# Altium project acondicionamiento.PrjPCB
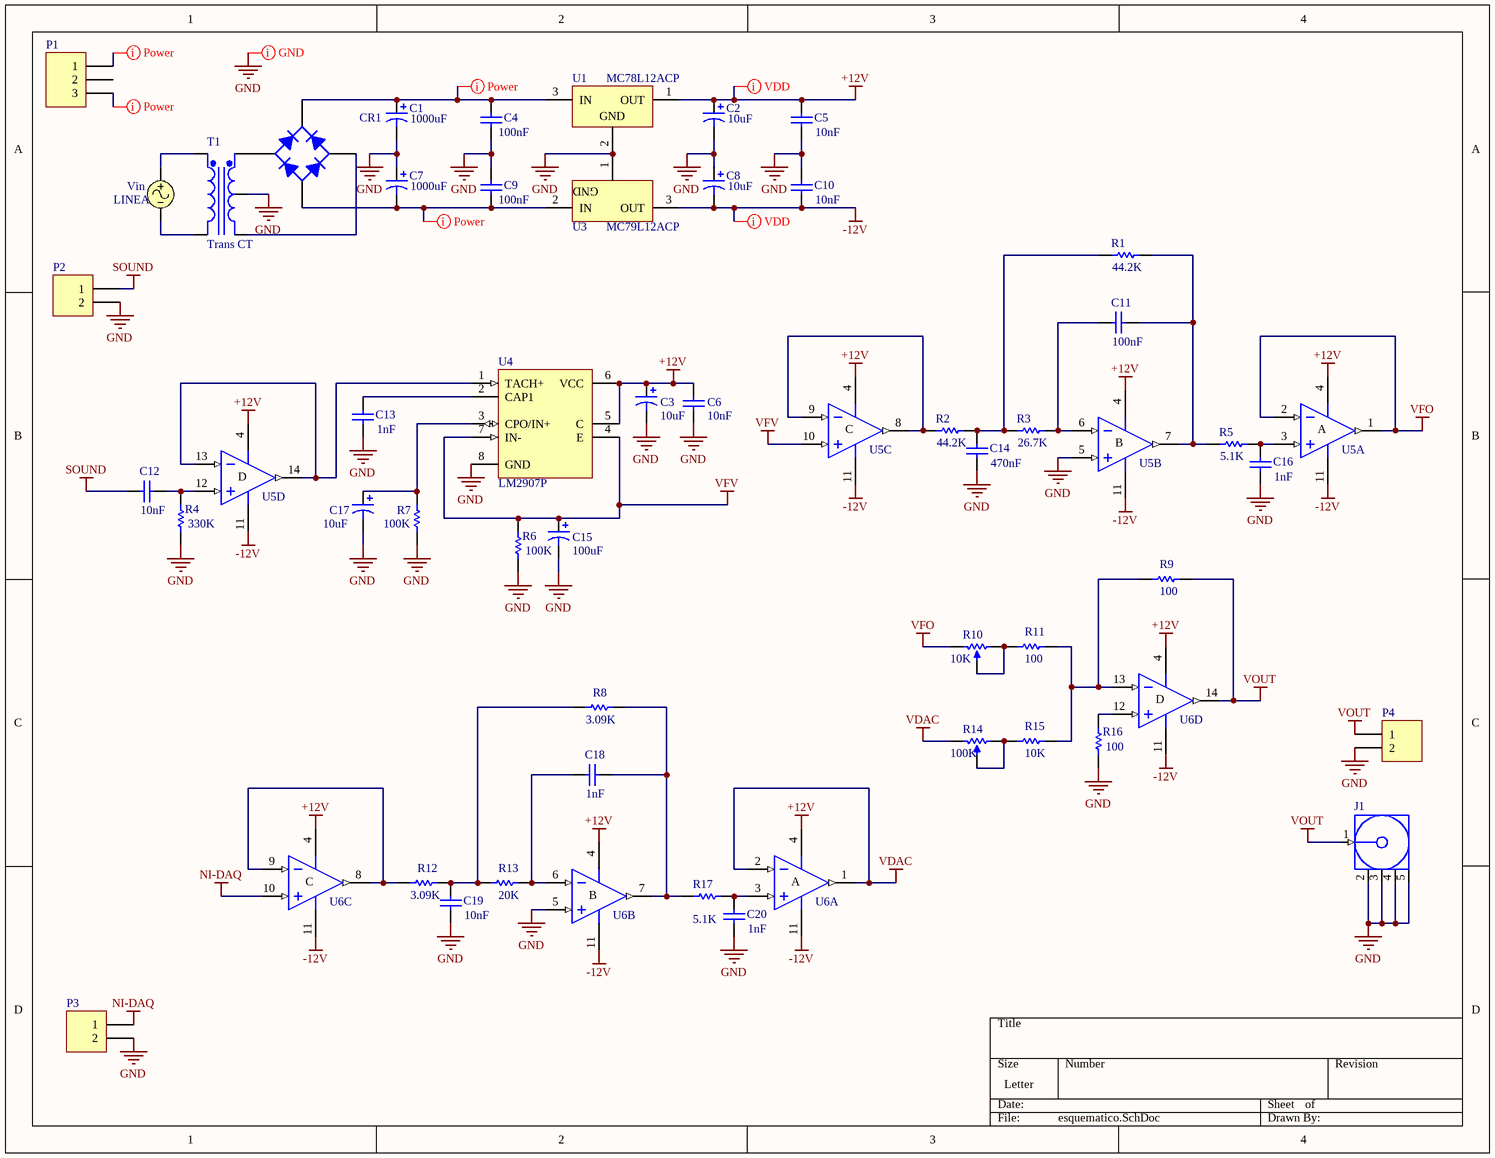
[diagram p0: esquematico.SchDoc]
1 sheet, 50 parts. Net scope: global (net labels, ports and power ports of the same name join across sheets).
Board file: tarjeta.PcbDoc

## Sheet esquematico.SchDoc
size Letter

### Parts
C1  value 1000uF  [CAPPR5-10x20/H1.1]  (hidden comment: Cap Pol1)
C2  value 10uF  [CAPPR2-5x11]  (hidden comment: Cap Pol1)
C3  value 10uF  [CAPPR2-5x11]  (hidden comment: Cap Pol1)
C4  value 100nF  [CAPR2.54-4x2.5]  (hidden comment: Cap)
C5  value 10nF  [CAPR2.54-4x2.5]  (hidden comment: Cap)
C6  value 10nF  [CAPR2.54-4x2.5]  (hidden comment: Cap)
C7  value 1000uF  [CAPPR5-10x20/H1.1]  (hidden comment: Cap Pol1)
C8  value 10uF  [CAPPR2-5x11]  (hidden comment: Cap Pol1)
C9  value 100nF  [CAPR2.54-4x2.5]  (hidden comment: Cap)
C10  value 10nF  [CAPR2.54-4x2.5]  (hidden comment: Cap)
C11  value 100nF  [CAPR2.54-4x2.5]  (hidden comment: Cap)
C12  value 10nF  [CAPR2.54-4x2.5]  (hidden comment: Cap)
C13  value 1nF  [CAPR5.08-4x2.5]  (hidden comment: Cap)
C14  value 470nF  [CAPR5.08-4x2.5]  (hidden comment: Cap)
C15  value 100uF  [CAPPR2.5-6.3x11]  (hidden comment: Cap Pol1)
C16  value 1nF  [CAPR5.08-5.1x2.5]  (hidden comment: Cap)
C17  value 10uF  [CAPPR2-5x11]  (hidden comment: Cap Pol1)
C18  value 1nF  [CAPR5.08-5.1x2.5]  (hidden comment: Cap)
C19  value 10nF  [CAPR2.54-4x2.5]  (hidden comment: Cap)
C20  value 1nF  [CAPR5.08-5.1x2.5]  (hidden comment: Cap)
CR1  2KBP005  [D-44]  (value not drawn)
J1  COAX-F  [MCX5.08-H5]  (value not drawn)
P1  Header 3  [HDR1X3]  (value not drawn)
P2  Header 2  [HDR1X2]  (value not drawn)
P3  Header 2  [HDR1X2]  (value not drawn)
P4  Header 2  [HDR1X2]  (value not drawn)
R1  value 44.2K  [AXIAL-0.3]  (hidden comment: Res1)
R2  value 44.2K  [AXIAL-0.3]  (hidden comment: Res1)
R3  value 26.7K  [AXIAL-0.3]  (hidden comment: Res1)
R4  value 330K  [AXIAL-0.3]  (hidden comment: Res1)
R5  value 5.1K  [AXIAL-0.3]  (hidden comment: Res1)
R6  value 100K  [AXIAL-0.3]  (hidden comment: Res1)
R7  value 100K  [AXIAL-0.3]  (hidden comment: Res1)
R8  value 3.09K  [AXIAL-0.3]  (hidden comment: Res1)
R9  value 100  [AXIAL-0.3]  (hidden comment: Res1)
R10  value 10K  [3006P]  (hidden comment: RTrimPot)
R11  value 100  [AXIAL-0.3]  (hidden comment: Res1)
R12  value 3.09K  [AXIAL-0.3]  (hidden comment: Res1)
R13  value 20K  [AXIAL-0.3]  (hidden comment: Res1)
R14  value 100K  [3006P]  (hidden comment: RTrimPot)
R15  value 10K  [AXIAL-0.3]  (hidden comment: Res1)
R16  value 100  [AXIAL-0.3]  (hidden comment: Res1)
R17  value 5.1K  [AXIAL-0.3]  (hidden comment: Res1)
T1  Trans CT  [TRF_5]
U1  MC78L12ACP  [BCY-W3/W]
U3  MC79L12ACP  [BCY-W3/W]
U4  LM2907P  [P008]
U5  TL084CN  [DIP14]  (value not drawn)  (parts A,B,C,D of 4)
U6  TL084CN  [DIP14]  (value not drawn)  (parts A,B,C,D of 4)
Vin  LINEA

### Nets
+12V: C2.1 C3.1 C5.1 C6.1 U1.1(OUT) U4.5(C) U4.6(VCC) U5.4(V+) U6.4(V+)
-12V: C8.2 C10.1 U3.3(OUT) U5.11(V-) U6.11(V-)
GND: C1.2 C2.2 C3.2 C4.2 C5.2 C6.2 C7.1 C8.1 C9.2 C10.2 C13.1 C14.2 C15.2 C16.1 C17.2 C19.2 C20.1 J1.2(GND) J1.3(GND) J1.4(GND) J1.5(GND) P2.2 P3.2 P4.2 R4.1 R6.1 R7.1 R16.1 T1.4(SecCT) U1.2(GND) U3.1(GND) U4.8(GND) U5.5(IN+) U6.5(IN+)
NI-DAQ: P3.1 U6.10(IN+)
SOUND: C12.2 P2.1
VDAC: R14.1 U6.1(OUT) U6.2(IN-)
VFO: R10.1 U5.1(OUT) U5.2(IN-)
VFV: C15.1 R6.2 U4.4(E) U4.7(IN-) U5.10(IN+)
VOUT: J1.1(Signal) P4.1 R9.2 U6.14(OUT)
NetC1_1: C1.1 C4.1 CR1.1(K) U1.3(IN)
NetC7_2: C7.2 C9.1 CR1.4(A) U3.2(IN)
NetC11_1: C11.1 R1.2 R5.1 U5.7(OUT)
NetC11_2: C11.2 R3.2 U5.6(IN-)
NetC12_1: C12.1 R4.2 U5.12(IN+)
NetC13_2: C13.2 U4.2(CAP1)
NetC14_1: C14.1 R1.1 R2.2 R3.1
NetC16_2: C16.2 R5.2 U5.3(IN+)
NetC17_1: C17.1 R7.2 U4.3(CPO/IN+)
NetC18_1: C18.1 R8.2 R17.1 U6.7(OUT)
NetC18_2: C18.2 R13.2 U6.6(IN-)
NetC19_1: C19.1 R8.1 R12.2 R13.1
NetC20_2: C20.2 R17.2 U6.3(IN+)
NetCR1_2: CR1.2(C) T1.3(Sec+)
NetCR1_3: CR1.3(C) T1.5(Sec-)
NetR2_1: R2.1 U5.8(OUT) U5.9(IN-)
NetR9_1: R9.1 R11.2 R15.2 U6.13(IN-)
NetR10_2: R10.2 R10.3 R11.1
NetR12_1: R12.1 U6.8(OUT) U6.9(IN-)
NetR14_2: R14.2 R14.3 R15.1
NetR16_2: R16.2 U6.12(IN+)
NetT1_1: T1.1(Pri+) Vin.1
NetT1_2: T1.2(Pri-) Vin.2
NetU4_1: U4.1(TACH+) U5.13(IN-) U5.14(OUT)

Not connected (* = marked no-connect by the designer): P1 1 2 3

### Layout directives
net class HighVoltageNets: NetC1_1, NetC7_2, NetP1_1, NetP1_3
net class PowerNets: +12V, -12V
net class GNDNet: GND

### Notes on the sheet
- Labels drawn without touching a wire or pin: GND
- (in symbol TL084CN, part A) A
- (in symbol TL084CN, part B) B
- (in symbol TL084CN, part C) C
- (in symbol TL084CN, part D) D

### Library data of the parts
C1-C3 C7 C8 C15 C17 = Cap Pol1: Polarized Capacitor (Radial); Published: 8-Jun-2000; LatestRevisionDate: 17-Jul-2002; LatestRevisionNote: Re-released for DXP Platform.; PackageReference: RB7.6-15; Publisher: Altium Limited
C4-C6 C9-C14 C16 C18-C20 = Cap: Capacitor; Published: 8-Jun-2000; LatestRevisionDate: 17-Jul-2002; LatestRevisionNote: Re-released for DXP Platform.; PackageReference: RAD-0.3; Publisher: Altium Limited
CR1 = 2KBP005: 2 Amp Single Phase Rectifier Bridge; Published: 8-Jun-2000; LatestRevisionDate: 17-Jul-2002; LatestRevisionNote: Re-released for DXP Platform.; DatasheetDocument: E2753A; PackageReference: D-44; Publisher: Altium Limited; ComponentLink1Description: Manufacturer Link; ComponentLink1URL: http://www.irf.com/; ComponentLink2Description: Datasheet; ComponentLink2URL: http://www.irf.com/product-info/datasheets/data/2kbb.pdf
J1 = COAX-F: RF Coaxial PCB Connector, MCX; Thru-Hole, Right-Angle Mount Socket, Blunt Post Terminal, 50 Ohm Impedance; PCB_Layout: Complies with manufacturer's recommendation.; DrillSize: Corresponds to nominal value.; Published: 15-Jul-2004; LatestRevisionDate: 15-Jul-2004; LatestRevisionNote: Component Replaced.; DatasheetDocument: 30-May-2003; PackageDocument: 04-Jul-1999; PackageReference: 919-119J-51AX; Publisher: Altium Limited; ComponentLink1Description: Manufacturer Link; ComponentLink1URL: http://www.amphenolrf.com/
P1 = Header 3: Header, 3-Pin; LatestRevisionDate: 17-Jul-2002; LatestRevisionNote: Re-released for DXP Platform.; Publisher: Altium Limited
P2-P4 = Header 2: Header, 2-Pin; LatestRevisionDate: 17-Jul-2002; LatestRevisionNote: Re-released for DXP Platform.; Publisher: Altium Limited
R1-R9 R11-R13 R15-R17 = Res1: Resistor; Published: 8-Jun-2000; LatestRevisionDate: 17-Jul-2002; LatestRevisionNote: Re-released for DXP Platform.; PackageReference: AXIAL-0.3; Publisher: Altium Limited
R10 R14 = RTrimPot: Rectangular Trimmer Potentiometer; Turns: 15; Wise: CW
T1 = Trans CT: Center-Tapped Transformer (Coupled Inductor Model); Published: 8-Jun-2000; LatestRevisionDate: 17-Jul-2002; LatestRevisionNote: Re-released for DXP Platform.; PackageReference: TRF_5; Publisher: Altium Limited
U1 = MC78L12ACP: Three-Terminal Low Current Positive Voltage Regulator; Published: 15-Apr-2002; DatasheetVersion: Oct-1999; PackageVersion: 1996; PackageReference: 29-04; Publisher: Altium Limited; PackageDescription: TO, Flat Index; 3 In-Line, Axial Leads; Body Dia. 4.8mm; Leads 0.48 x 0.51 mm (max); ComponentLink1Description: Manufacturer Link; ComponentLink1URL: http://www.onsemi.com/site/products/taxonomy/0,4438,503,00.html; ComponentLink2Description: Datasheet; ComponentLink2URL: http://www.onsemi.com/pub/Collateral/MC78L00A-D.PDF
U3 = MC79L12ACP: Three-Terminal Low Current Negative Voltage Regulator; Published: 15-Apr-2002; DatasheetVersion: 1996; PackageVersion: 1996; PackageReference: 29-04; Publisher: Altium Limited; PackageDescription: TO, Flat Index; 3 In-Line, Axial Leads; Body Dia. 4.8mm; Leads 0.48 x 0.51 mm (max); ComponentLink1Description: Manufacturer Link; ComponentLink1URL: http://www.onsemi.com/site/products/taxonomy/0,4438,503,00.html; ComponentLink2Description: Datasheet; ComponentLink2URL: http://www.onsemi.com/pub/Collateral/MC79L00-D.PDF
U4 = LM2907P: Frequency-To-Voltage Converters; Published: 15-Apr-2002; LatestRevisionDate: 08-Jul-2005; LatestRevisionNote: Stylized 3D Model Added.; DatasheetVersion: Oct-1988; PackageVersion: Jun-1999; PackageReference: P008; Publisher: Altium Limited; PackageDescription: DIP; 8 Leads; Row Spacing 7.62 mm; Pitch 2.54 mm; Code_JEDEC: MO-001-AN; ComponentLink1Description: Manufacturer Link; ComponentLink1URL: http://www.ti.com/
U5 U6 = TL084CN: General-Purpose J-FET Quad Operational Amplifier; Published: 24-Aug-2001; LatestRevisionDate: 06-Jun-2005; LatestRevisionNote: Stylized 3D Model Added.; DatasheetVersion: Jan-1999; PackageVersion: Jan-1997; PackageReference: DIP14; Publisher: Altium Limited; PackageDescription: DIP; 14 Leads; Row Spacing 7.62 mm; Pitch 2.54 mm; ComponentLink1Description: Manufacturer Link; ComponentLink1URL: http://www.st.com/; ComponentLink2Description: Datasheet; ComponentLink2URL: http://www.st.com/stonline/products/literature/ds/2301/tl084.pdf
Vin = VSIN: Sinusoidal Voltage Source; Note: PCB Footprint - Not required; Published: 8-Jun-2000; LatestRevisionDate: 15-Nov-2004; LatestRevisionNote: Corrected Netlist.; PackageReference: Not Applicable; Publisher: Altium Limited